# Altium schematic sheet external.SchDoc
size A4; Organization: Medical Technologies CZ a.s.; SheetNumber: 10; SheetTotal: 10; Version1: N/A; Version2: N/A; Version3: N/A; Change1description: N/A; Change2description: N/A; Change3description: N/A; Change1DrawnBy: N/A; Change2DrawnBy: N/A; Change3DrawnBy: N/A; Change1CheckedBy: N/A; Change2CheckedBy: N/A; Change3CheckedBy: N/A; PreviusVersion_Chng1: N/A; PreviusVersion_Chng2: N/A; PreviusVersion_Chng3: N/A; Variant1description: Standard assembly; Variant2description: N/A; Variant3description: N/A; Variant4description: N/A; PrimaryCard1: XXXxxxXXX; PrimaryCard2: N/A; PrimaryCard3: N/A; PrimaryCard4: N/A; SPICEModelCacheCBAVRFGJ: <root> / <DocumentId>CBAVRFGJ</DocumentId> / <CacheFrame Number="0"> / <Model Name="cl10b104kb8nnn" Kind="CKT"> / <Text>* CL10B104KB8NNN Multilayer Ceramic Capacitor Spice Model / *----------------------------------------------------------------------------------------------- / * Model Generated by Samsung Electro-Mechanics / * Samsung Spice Model Version 4.0 / * Products : Multilayer Ceramic Capacitor(General) / *----------------------------------------------------------------------------------------------- / * Characteristics : / * / *     Nominal Capacitance = 100nF / *     Capacitance Tolerance = +/-10% / *     TCC = X7R(-55 ~ +125 Cels.) / *     Rated Voltage = 50Vdc / *     Size = 0603(unit:inch), 1608(unit:mm) / *     Length = 1.60 +/-0.10 mm / *     Width = 0.80 +/-0.10 mm / *     Thickness = 0.80 +/-0.10 mm / *     Measurement Temperature : 25Cels. / *     DC bias Value = 0V / *     Frequency : 100Hz ~ 6GHz / *----------------------------------------------------------------------------------------------- / * External Node Assignments : / * / *  1  o---||---o  2 / * / *----------------------------------------------------------------------------------------------- / .SUBCKT CL10B104KB8NNN 1 2 / C1 1 3 9.77779E-08 / C16 17 18 5.88581E-06 / C17 18 19 1.59883E-05 / C18 19 20 2.23415E-04 / C19 20 21 2.53303E-04 / C2 3 4 4.35730E-06 / C20 21 22 2.53303E-04 / C21 22 23 2.53303E-04 / C22 23 24 2.53303E-04 / C23 24 25 2.15084E-07 / C24 25 26 2.53303E-04 / C25 26 27 2.53303E-04 / C26 27 28 1.17756E-11 / C27 28 2 1.47146E-11 / C3 4 5 5.29040E-06 / C4 5 6 4.77639E-06 / C5 6 7 4.40289E-06 / C6 7 8 6.13401E-06 / C7 8 9 3.96026E-06 / C8 9 10 1.05023E-06 / R1 1 3 1.00000E+08 / R11 12 13 5.22090E-02 / R12 13 14 7.93644E-02 / R13 14 15 1.00000E-06 / R14 15 16 1.00000E-06 / R15 16 17 1.00000E-06 / R16 17 18 1.28418E-02 / R17 18 19 1.33549E-03 / R18 19 20 5.00746E-04 / R19 20 21 1.00000E-06 / R2 3 4 1.20052E+03 / R20 21 22 1.00000E-06 / R21 22 23 1.00000E-06 / R22 23 24 1.00000E-06 / R23 24 25 1.43830E-02 / R24 25 26 1.00000E-06 / R25 26 27 1.00000E-06 / R26 27 28 8.70334E+00 / R27 28 2 4.40128E+00 / R3 4 5 1.73528E+02 / R4 5 6 3.26179E+01 / R5 6 7 5.92116E+00 / R6 7 8 6.17312E-01 / R7 8 9 1.09178E-01 / R8 9 10 8.30916E-04 / R9 10 11 2.00906E-02 / L10 11 12 1.28321E-10 / L11 12 13 7.89377E-11 / L12 13 14 2.11392E-11 / L13 14 15 1.00000E-10 / L14 15 16 1.00000E-10 / L15 16 17 1.00000E-10 / L16 17 18 3.76696E-09 / L17 18 19 2.57357E-10 / L18 19 20 5.61226E-12 / L19 20 21 1.00000E-10 / L20 21 22 1.00000E-10 / L21 22 23 1.00000E-10 / L22 23 24 1.00000E-10 / L23 24 25 2.12983E-11 / L24 25 26 1.00000E-10 / L25 26 27 1.00000E-10 / L26 27 28 4.22009E-11 / L27 28 2 6.31025E-11 / .ENDS CL10B104KB8NNN</Text> / </Model> / </CacheFrame> / </root>; DocumentName: Docname
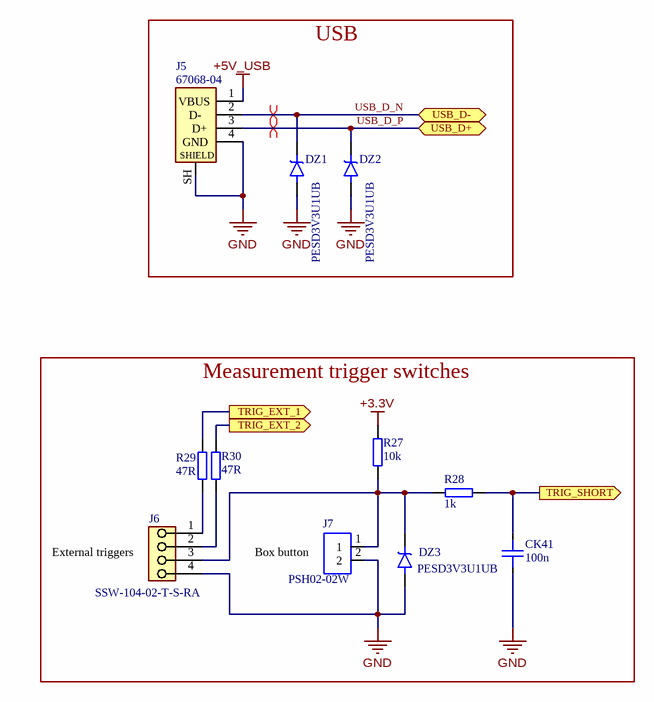
[diagram p0: external.SchDoc]

## Parts
CK41  100n  [CAPC1608X09N(SMC0603)]
DZ1  PESD3V3U1UB  [SODFL160X65-2N(SC79)]
DZ2  PESD3V3U1UB  [SODFL160X65-2N(SC79)]
DZ3  PESD3V3U1UB  [SODFL160X65-2N(SC79)]
J5  67068-04  [USB-B]
J6  SSW-104-02-T-S-RA  [SSW-104-02-T-S-RA]
J7  PSH02-02W  [Official_PSH0202W]
R27  10k  [RESC2012X06N(SMR0805)]
R28  1k  [RESC2012X06N(SMR0805)]
R29  47R  [RESC2012X06N(SMR0805)]
R30  47R  [RESC2012X06N(SMR0805)]

## Blocks framed on the sheet
USB: DZ1 DZ2 J5
Measurement trigger switches: CK41 DZ3 J6 J7 R27-R30

## Ports
TRIG_EXT_1 (out), TRIG_EXT_2 (out), TRIG_SHORT (out), USB_D+ (bidir), USB_D- (bidir)

## Nets
+3.3V: R27.2
+5V_USB: J5.1(VBUS)
GND: CK41.2 DZ1.2(A) DZ2.2(A) DZ3.2(A) J5.4(GND) J5.SH(SHIELD) J6.4 J7.2
TRIG_EXT_1: R29.2 ; port TRIG_EXT_1
TRIG_EXT_2: R30.2 ; port TRIG_EXT_2
TRIG_SHORT: CK41.1 R28.1 ; port TRIG_SHORT
USB_D_N: DZ1.1(C) J5.2(D-) ; port USB_D-
USB_D_P: DZ2.1(C) J5.3(D+) ; port USB_D+
NetDZ3_1: DZ3.1(C) J6.3 J7.1 R27.1 R28.2
NetJ6_1: J6.1 R29.1
NetJ6_2: J6.2 R30.1

## Layout directives
differential pair: USB_D_N, USB_D_P

## Notes on the sheet
- (near J6) External triggers
- (near J7) Box button
- Číslo výkresu /drawing number/:
- Nazev listu/sheet name/:
- DPS projekt/PCB project/:
- Kreslil /drawn by/ :
- Kontroloval /checked by/:
- Datum /date/:
- List /sheet/:
- /

## Library data of the parts
CK41 = ECK+100N50V0603XXK: C; 100n; 50V; 10%; X7R; ??;; Manufacturer: SAMSUNG EM: CL10B104KB8NNNC;;SAMSUNG EM: CL10B104KB8NNNO;;SAMSUNG EM: CL10B104KB8NNND; Component_Class: Capacitor; Status_I: Production; Status_II: Active; Tolerance_Pct: 10; Voltage_Rating_V: 50; Capacitance_F: 1E-7; KK: ECK+100N50V0603XXK; Value: 100n; SMD: 1; ComponentLink2URL: i:\datasheets\ECK+100N50V0603XXK_SamsungEN100.pdf; ComponentLink2Description: ECK+100N50V0603XXK_SamsungEN100.pdf; ComponentLink3URL: I:\datasheets\ECK+100N50V0603XXK_Samsung_2EN100.pdf.pdf; ComponentLink3Description: ECK+100N50V0603XXK_Samsung_2EN100.pdf.pd; Dielectric_Type: X7R; ComponentLink1URL: heliosgreen://v1/hegMT/5-MT/Classes(343)/Folders/OpenForm?RecordNumbers=[6094397]; ComponentLink1Description: Helios
DZ1-DZ3 = ED+PESD3V3U1UBXX0: CP; Voltage [V] - Unidirectional; 4.5; R:Yes; 1x;; Manufacturer: Nexperia: PESD3V3U1UB,115;;NXP: PESD3V3U1UB,115; Component_Class: Circuit Protection; Status_I: Production; Status_II: Active; Multiplicity: 1; Resettable: Yes; Trip_Threshold: 4.5; KK: ED+PESD3V3U1UBXX0; Value: PESD3V3U1UB; SMD: 1; ComponentLink2URL: I:\DataSheets\ED+PESD3V3U1UBXX0_NexperiaEN100.pdf; ComponentLink2Description: ED+PESD3V3U1UBXX0_NexperiaEN100.pdf; Physical_Quantity: Voltage [V] - Unidirectional; ComponentLink1URL: heliosgreen://v1/hegMT/5-MT/Classes(343)/Folders/OpenForm?RecordNumbers=[10662650]; ComponentLink1Description: Helios
J5 = EJ-67068-04XX0: Con; USB; 1x; PCB; Right angle; 250V; 1.5A; Female; Gold; ??;; Manufacturer: HSUAN MAO: C8317-04BFHSB0R;;HSM: C8317-04BFHSB0R; Note: USB B; Component_Class: Connector; Status_I: Production; Status_II: Active; Multiplicity: 1; Voltage_Rating_V: 250; Current_Rating_A: 1.5; KK: EJ-67068-04XX0; Value: 67068-04; SMD: 0; ComponentLink2URL: i:\datasheets\EJ-67068-04XX0_Hsuan Mao.pdf; ComponentLink2Description: EJ-67068-04XX0_Hsuan Mao.pdf; Mounting_Style: PCB; Connector_Family: USB; Angle: Right angle; Gender: Female; Plating: Gold; ComponentLink1URL: heliosgreen://v1/hegMT/5-MT/Classes(343)/Folders/OpenForm?RecordNumbers=[380719]; ComponentLink1Description: Helios; System: Connector
J6 = SSW-104-02-T-S-RA: Female Header, Single row, 1 x 4, R/A, THT
J7 = EJ-PSH0202WXX0: Con; PFH/PSH; 2x; PCB; Right angle; 250V; 3A; Male; Tin; ??;; Manufacturer: Neltron: 2217R-XX-WH2; Component_Class: Connector; Status_I: Production; Status_II: Active; Multiplicity: 2; Voltage_Rating_V: 250; Current_Rating_A: 3; KK: EJ-PSH0202WXX0; Value: PSH02-02W; SMD: 0; ComponentLink2URL: I:\datasheets\EJ-PSH0202WXX0_NeltronEN100.pdf; ComponentLink2Description: EJ-PSH0202WXX0_NeltronEN100.pdf; Mounting_Style: PCB; Connector_Family: PFH/PSH; Angle: Right angle; Gender: Male; Plating: Tin; ComponentLink1URL: heliosgreen://v1/hegMT/5-MT/Classes(343)/Folders/OpenForm?RecordNumbers=[380843]; ComponentLink1Description: Helios; System: Connector
R27 = ER+10K0.1WXXF: R; 10k; 0.125W; 1%; 150V; Thick Film; ±100ppm/K; 1x;; Manufacturer: VISHAY: CRCW0805 10KOHM TK100 1%;;AVX: CR21-1002F-T;;BC Components: MCU0805-50 1% P5 10k;;YAGEO: RC0805FR-0710KL;;PANASONIC: ERJ 6EN F 1002 V;;HaS Lanskroun: CMF0805 10k 1% 100ppm/K;;ASJ: CR21-1002-FL; Component_Class: Resistor; Status_I: Production; Status_II: Active; Tolerance_Pct: 1; Voltage_Rating_V: 150; Resistance_Ohm: 10000; Power_Rating_W: 0.125; Temperature_Coefficient_PPMpK: ±100; KK: ER+10K0.1WXXF; Value: 10k; SMD: 1; ComponentLink2URL: i:\DataSheets\ER+0.1WXXF_Yageo.pdf; ComponentLink2Description: ER+0.1WXXF_Yageo.pdf; Multiplicity: 1; Resistor_Type: Thick Film; ComponentLink1URL: heliosgreen://v1/hegMT/5-MT/Classes(343)/Folders/OpenForm?RecordNumbers=[381481]; ComponentLink1Description: Helios
R28 = ER+1K0.1WXXF: R; 1k; 0.125W; 1%; 150V; Thick Film; ±100ppm/K; 1x;; Manufacturer: VISHAY: CRCW0805 1001 100 1% RT1 BC;;AVX: CR21-1001F-T;;BC Components: MCU0805-50 1% P5 1k0;;YAGEO: RC0805FR-071KL;;PANASONIC: ERJ 6EN F 1001 V;;HaS Lanskroun: CMF0805 1k0 1% 100ppm/K;;ASJ: CR21-1001-FL; Component_Class: Resistor; Status_I: Production; Status_II: Active; Tolerance_Pct: 1; Voltage_Rating_V: 150; Resistance_Ohm: 1000; Power_Rating_W: 0.125; Temperature_Coefficient_PPMpK: ±100; KK: ER+1K0.1WXXF; Value: 1k; SMD: 1; ComponentLink2URL: i:\DataSheets\ER+0.1WXXF_Yageo.pdf; ComponentLink2Description: ER+0.1WXXF_Yageo.pdf; Multiplicity: 1; Resistor_Type: Thick Film; ComponentLink1URL: heliosgreen://v1/hegMT/5-MT/Classes(343)/Folders/OpenForm?RecordNumbers=[381513]; ComponentLink1Description: Helios
R29 R30 = ER+47R0.1WXXF: R; 47R; 0.125W; 1%; 150V; Thick Film; ±100ppm/K; 1x;; KK: ER+47R0.1WXXF